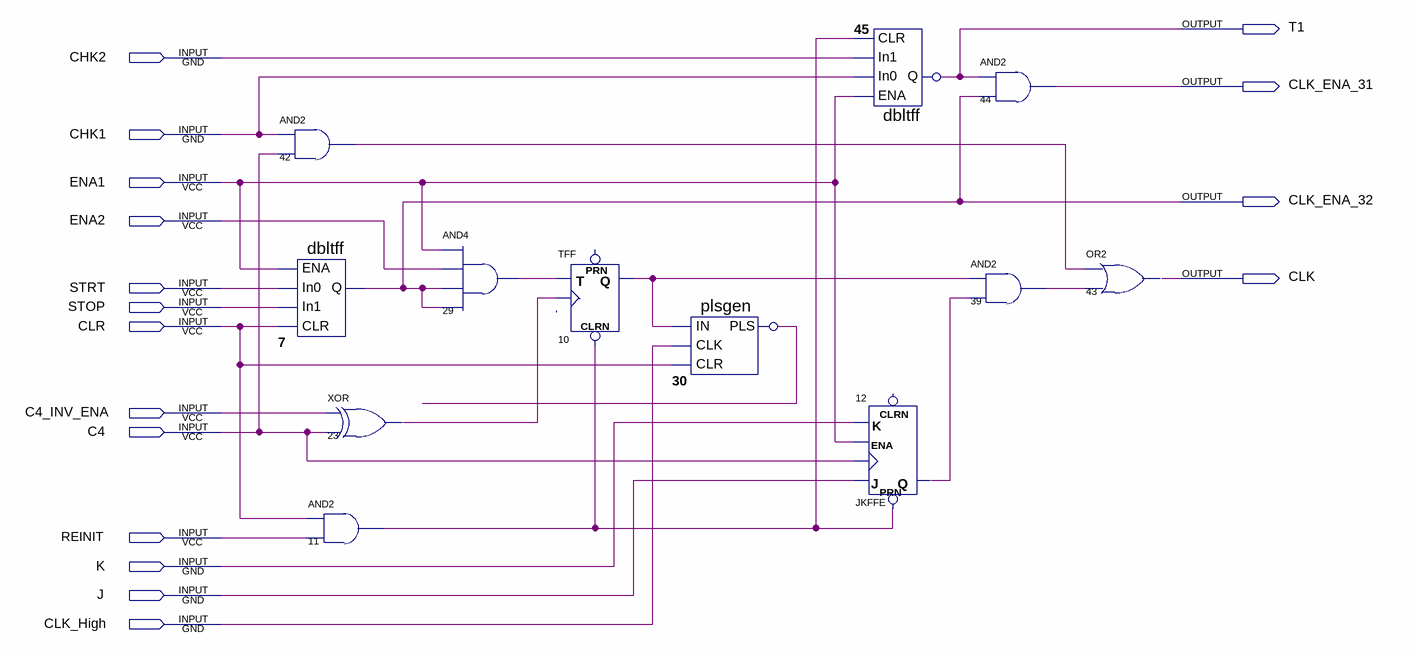
[diagram p0: schematic sheet]
// Quartus schematic ch_clk_ctrl2.bdf as structural Verilog: 12 symbols, 17 pins
module ch_clk_ctrl2 (
  input  CHK2,
  input  CHK1,
  input  ENA1,
  input  ENA2,
  input  STRT,
  input  STOP,
  input  CLR,
  input  C4_INV_ENA,
  input  C4,
  input  REINIT,
  input  K,
  input  J,
  input  CLK_High,
  output T1,
  output CLK_ENA_31,
  output CLK_ENA_32,
  output CLK
);

  wire n10_q, n11_out, n12_q, n23_out, n29_out, n30_pls, n30_PLS_inverted_out, n39_out, n42_out, n45_q;

  and u_42 (n42_out, CHK1, C4);
  dbltff u_7 (.ENA(ENA1), .In0(STRT), .In1(STOP), .CLR(CLR), .Q(CLK_ENA_32));
  xor u_23 (n23_out, C4_INV_ENA, C4);
  and u_11 (n11_out, CLR, REINIT);
  and u_29 (n29_out, ENA1, ENA2, CLK_ENA_32, CLK_ENA_32);
  TFF u_10 (.CLRN(n11_out), .T(n29_out), .CLK(n23_out), .Q(n10_q));  // open: PRN
  plsgen u_30 (.IN(n10_q), .CLK(CLK_High), .CLR(CLR), .PLS(n30_pls));
  not u_30_PLS_inverted (n30_PLS_inverted_out, n30_pls);
  dbltff u_45 (.ENA(ENA1), .In0(CHK1), .In1(CHK2), .CLR(n11_out), .Q(n45_q));
  not u_45_Q_inverted (T1, n45_q);
  JKFFE u_12 (.PRN(n11_out), .J(J), .CLK(C4), .K(K), .ENA(ENA1), .Q(n12_q));  // open: CLRN
  and u_44 (CLK_ENA_31, T1, CLK_ENA_32);
  and u_39 (n39_out, n10_q, n12_q);
  or u_43 (CLK, n42_out, n39_out);
endmodule
